# Altium schematic sheet IO_Bus_Switch.SchDoc: IO Bus Switch
size A4; DocumentNumber: 5; SheetNumber: 5; SheetTotal: 12
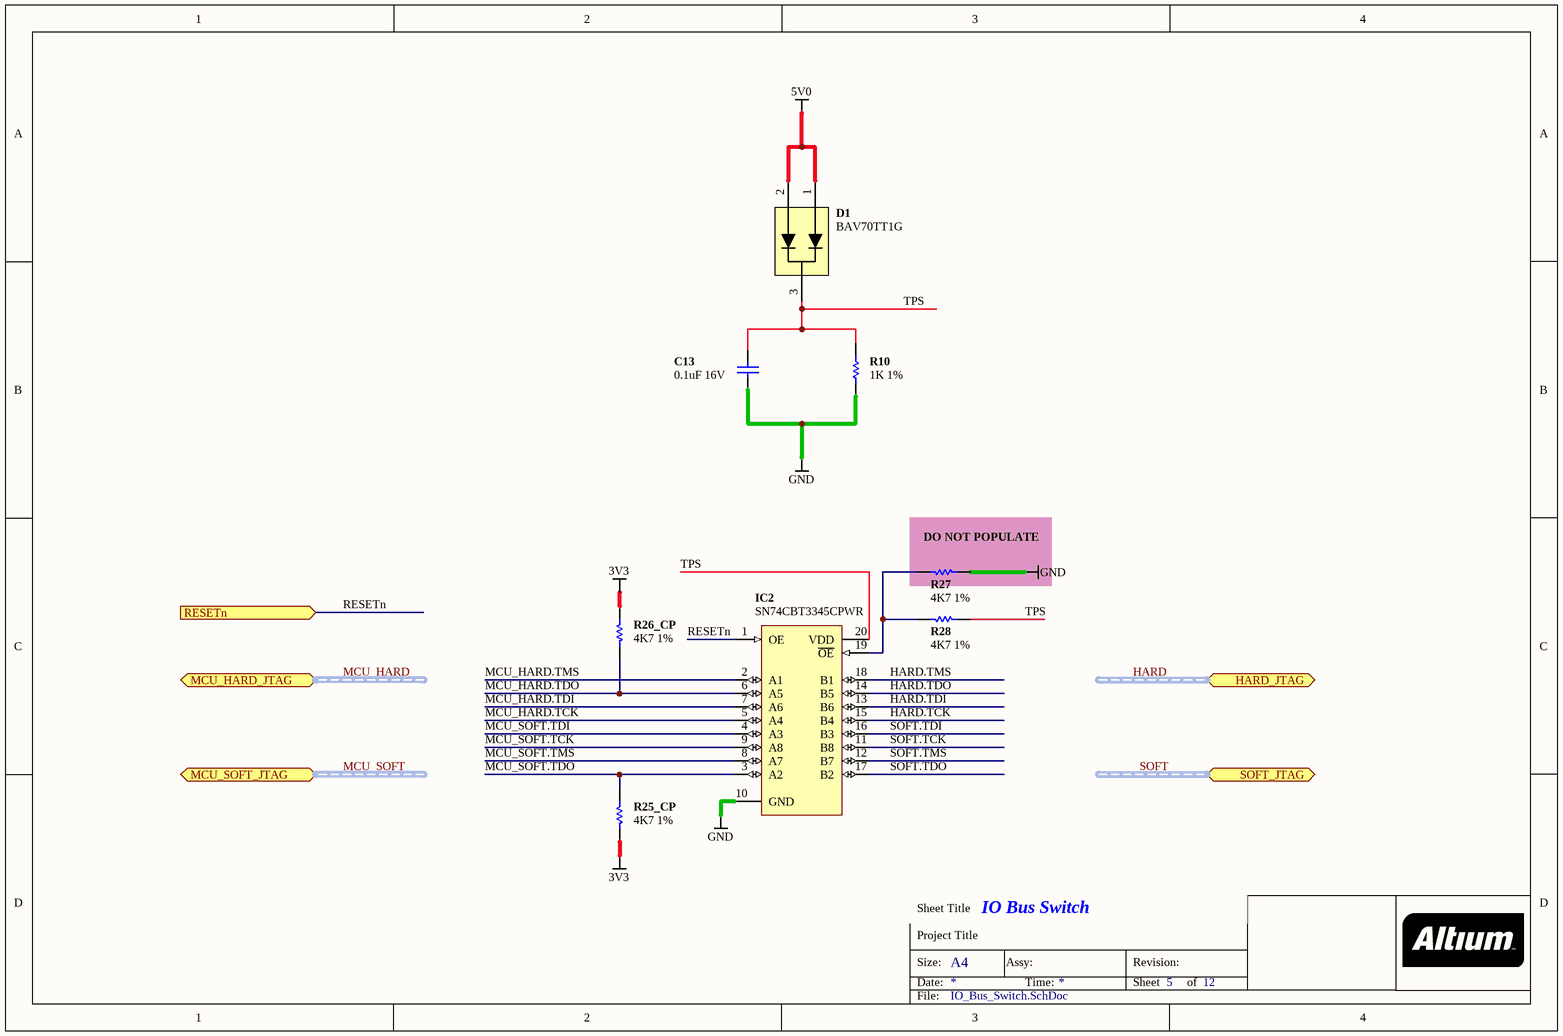
[diagram p0: IO_Bus_Switch.SchDoc]

## Parts
C13  0.1uF 16V  [CAPC1005-STAR]
D1  BAV70TT1G  [SOT95P230-3]
IC2  SN74CBT3345CPWR  [TSOP65P650-20]
R10  1K 1%  [RESC1005-STAR]
R25_CP  4K7 1%  [RESC1005-STAR]
R26_CP  4K7 1%  [RESC1005-STAR]
R27  4K7 1%  [RESC1005-STAR]  (no BOM)
R28  4K7 1%  [RESC1005-STAR]

## Blocks framed on the sheet
DO NOT POPULATE: R27

## Ports
HARD_JTAG (harness JTAG), MCU_HARD_JTAG (harness JTAG), MCU_SOFT_JTAG (harness JTAG), RESETn (in), SOFT_JTAG (harness JTAG)

## Nets
3V3: R25_CP.2 R26_CP.2
5V0: D1.1 D1.2
GND: C13.2 IC2.10(GND) R10.2 R27.1
HARD.TCK: IC2.15(B4)
HARD.TDI: IC2.13(B6)
HARD.TDO: IC2.14(B5)
HARD.TMS: IC2.18(B1)
MCU_HARD.TCK: IC2.5(A4)
MCU_HARD.TDI: IC2.7(A6)
MCU_HARD.TDO: IC2.6(A5) R26_CP.1
MCU_HARD.TMS: IC2.2(A1)
MCU_SOFT.TCK: IC2.9(A8)
MCU_SOFT.TDI: IC2.4(A3)
MCU_SOFT.TDO: IC2.3(A2) R25_CP.1
MCU_SOFT.TMS: IC2.8(A7)
RESETn: IC2.1(OE) ; port RESETn
SOFT.TCK: IC2.11(B8)
SOFT.TDI: IC2.16(B3)
SOFT.TDO: IC2.17(B2)
SOFT.TMS: IC2.12(B7)
TPS: C13.1 D1.3 IC2.20(VDD) R10.1 R28.1
NetIC2_19: IC2.19(~{OE}) R27.2 R28.2

## Buses and harness runs
harness HARD = port HARD_JTAG
harness MCU_HARD = port MCU_HARD_JTAG
harness MCU_SOFT = port MCU_SOFT_JTAG
harness SOFT = port SOFT_JTAG

## Notes on the sheet
- Sheet Title
- Project Title
- Size:
- Date:
- A4
- Assy:
- Time:
- Revision:
- Sheet
- of
- File:

## Library data of the parts
C13 = D-101-0080: Capacitor, Ceramic, 0.1uF 10% 16V 0402 (1005) X7R; Polarity: Non-Polarized; Capacitance: 0.1 uF; Category: Capacitor; Dielectric: X7R; Mounting Technology: Surface Mount; Rated Voltage: 16 V; Status: Production; Technology: Ceramic; Tolerance: 10 %
D1 = D-155-0000: Dual Switching Diode; Max Forward Current: 200 mA; Rated Voltage: 70 V; Mounting Technology: Surface Mount; Status: Production; Category: Signal Diode
IC2 = D-205-0005: SN74CBT3345CPWR; HIGH SPEED 8-BIT BUS SWITCH; Mounting Technology: Surface Mount; Status: Production; Category: IC-Logic
R10 = D-100-0121: Resistor, 1K 1% 0402 (1005); Power Rating: 63 mW; Category: Resistor; Mounting Technology: Surface Mount; Resistance: 1 K; Status: Production; Tolerance: 1 %
R25_CP R26_CP R27 R28 = D-100-0088: Resistor, 4K7 1% 0402 (1005); Power Rating: 63 mW; Resistance: 4.7 K; Category: Resistor; Mounting Technology: Surface Mount; Status: Production; Tolerance: 1 %